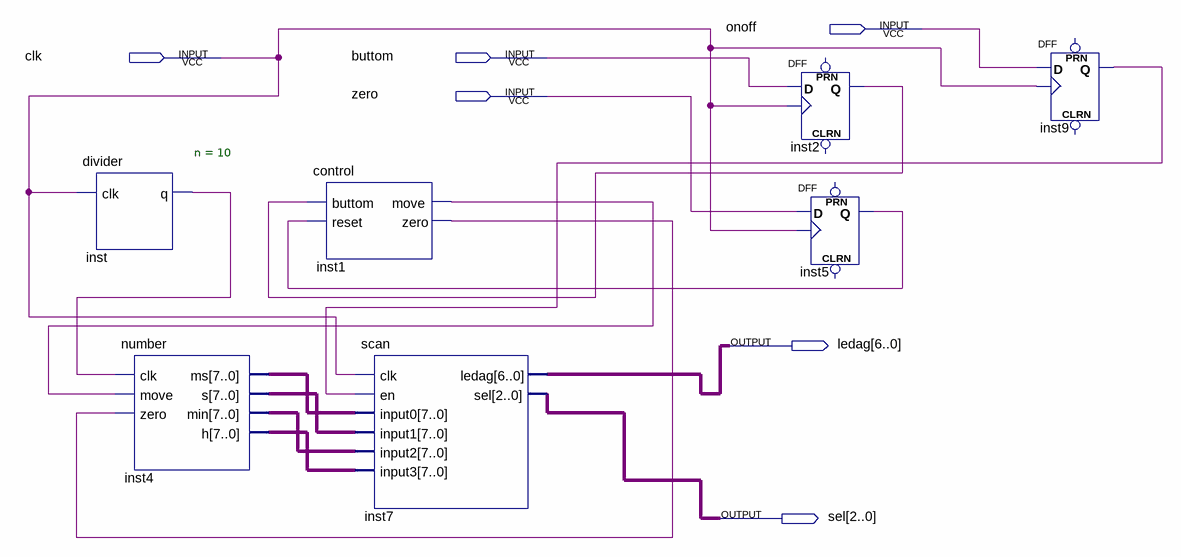
[diagram p0: schematic sheet]
// Quartus schematic clock.bdf as structural Verilog: 7 symbols, 6 pins
module clock (
  input  onoff,
  input  clk,
  input  buttom,
  input  zero,
  output [6:0] ledag,
  output [2:0] sel
);

  wire inst1_move, inst1_zero, inst2_q, inst5_q, inst9_q, inst_q;
  wire [7:0] inst4_h, inst4_min, inst4_ms, inst4_s;

  divider #(.n(10)) inst (.clk(clk), .q(inst_q));
  number inst4 (
    .clk(inst_q), .move(inst1_move), .zero(inst1_zero), .ms(inst4_ms), .s(inst4_s), .min(inst4_min),
    .h(inst4_h));
  control inst1 (.buttom(inst2_q), .reset(inst5_q), .move(inst1_move), .zero(inst1_zero));
  scan inst7 (
    .clk(clk), .en(inst9_q), .input0(inst4_ms), .input1(inst4_s), .input2(inst4_min), .input3(inst4_h),
    .ledag(ledag), .sel(sel));
  DFF inst2 (.CLK(clk), .D(buttom), .Q(inst2_q));  // open: CLRN, PRN
  DFF inst5 (.CLK(clk), .D(zero), .Q(inst5_q));  // open: CLRN, PRN
  DFF inst9 (.CLK(clk), .D(onoff), .Q(inst9_q));  // open: CLRN, PRN
endmodule
